# Altium schematic sheet MotorCtrl.SchDoc
size A4; Revision: B.1(PCB.SCH)
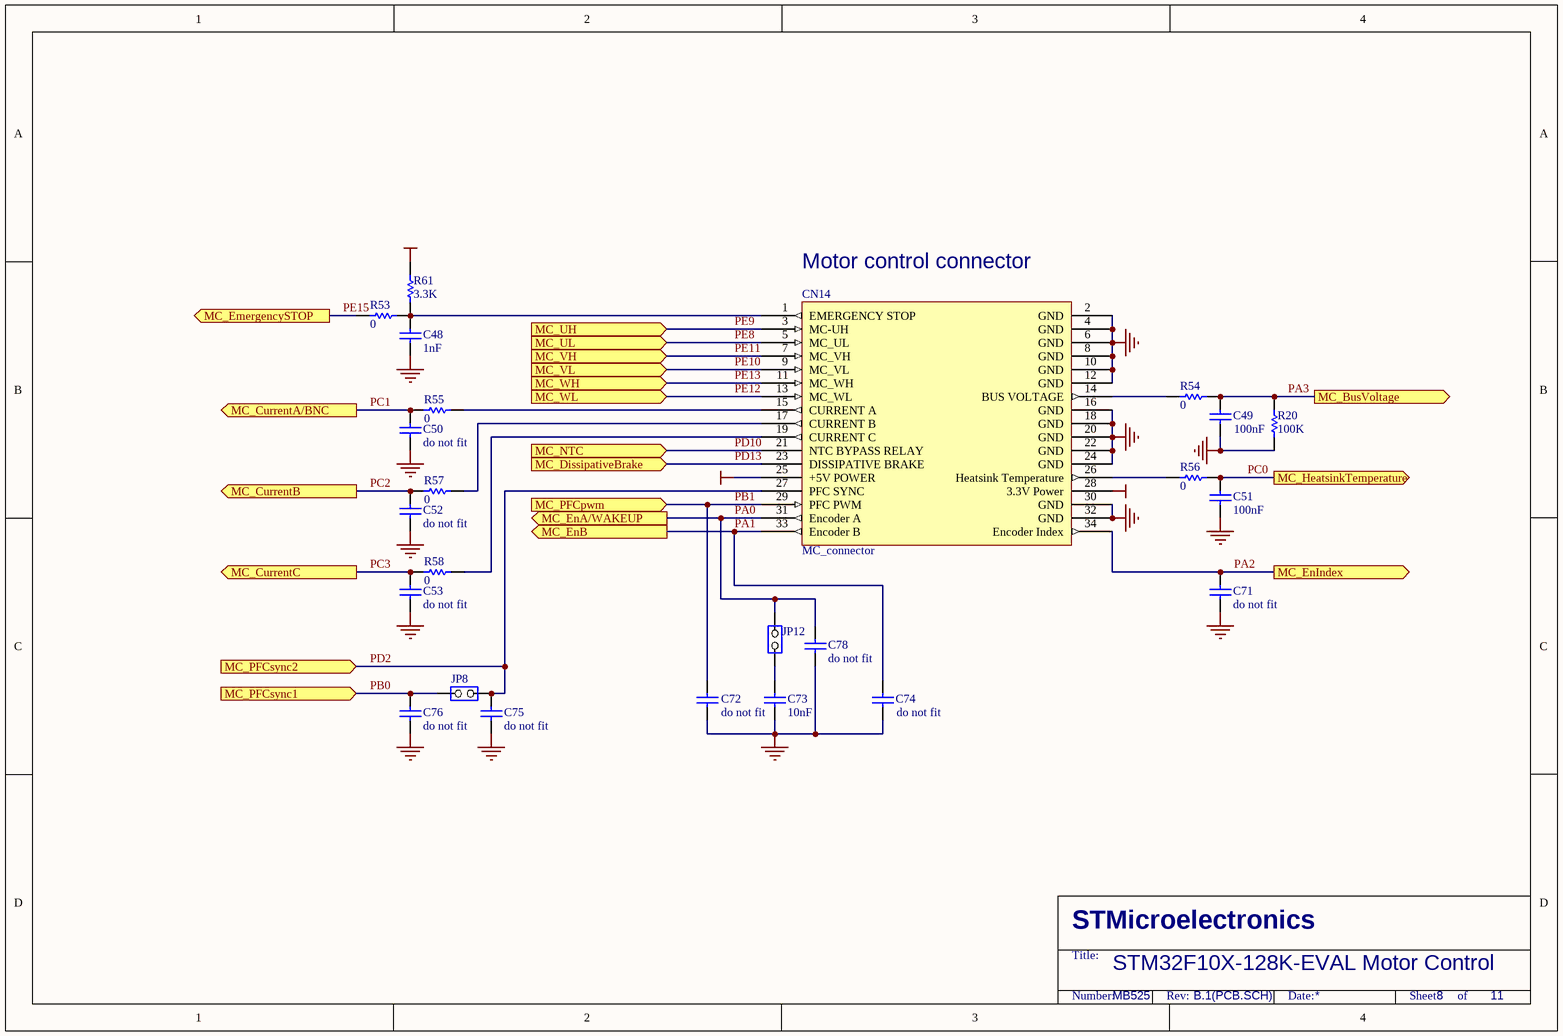
[diagram p0: MotorCtrl.SchDoc]

## Parts
C48  1nF  [0603]
C49  100nF  [0603]
C50  do not fit  [0603]
C51  100nF  [0603]
C52  do not fit  [0603]
C53  do not fit  [0603]
C71  do not fit  [0603]
C72  do not fit  [0603]
C73  10nF  [0603]
C74  do not fit  [0603]
C75  do not fit  [0603]
C76  do not fit  [0603]
C78  do not fit  [0603]
CN14  MC_connector  [IDC34S]
JP8  (no value)  [SIP2]
JP12  (no value)  [SIP2]
R20  100K  [0603]
R53  0  [0805]
R54  0  [0603]
R55  0  [0603]
R56  0  [0603]
R57  0  [0603]
R58  0  [0603]
R61  3.3K  [0603]

## Ports
MC_BusVoltage (out), MC_CurrentA/BNC (out), MC_CurrentB (out), MC_CurrentC (out), MC_DissipativeBrake (in), MC_EmergencySTOP (out), MC_EnA/WAKEUP (out), MC_EnB (out), MC_EnIndex (out), MC_HeatsinkTemperature (out), MC_NTC (in), MC_PFCpwm (in), MC_PFCsync1 (in), MC_PFCsync2 (in), MC_UH (in), MC_UL (in), MC_VH (in), MC_VL (in), MC_WH (in), MC_WL (in)

## Nets
+3V3: CN14.28(3.3V_Power) R61.2
+5V: CN14.25(+5V_POWER)
GND: C48.1 C49.1 C50.1 C51.1 C52.1 C53.1 C71.1 C72.1 C73.1 C74.1 C75.1 C76.1 C78.1 CN14.2(GND) CN14.4(GND) CN14.6(GND) CN14.8(GND) CN14.10(GND) CN14.12(GND) CN14.16(GND) CN14.18(GND) CN14.20(GND) CN14.22(GND) CN14.24(GND) CN14.30(GND) CN14.32(GND) R20.1
PA0: C78.2 CN14.31(Encoder_A) JP12.1(COMMON) ; port MC_EnA/WAKEUP
PA1: C74.2 CN14.33(Encoder_B) ; port MC_EnB
PA2: C71.2 CN14.34(Encoder_Index) ; port MC_EnIndex
PA3: C49.2 R20.2 R54.2 ; port MC_BusVoltage
PB0: C76.2 JP8.2(NO) ; port MC_PFCsync1
PB1: C72.2 CN14.29(PFC_PWM) ; port MC_PFCpwm
PC0: C51.2 R56.2 ; port MC_HeatsinkTemperature
PC1: C50.2 R55.1 ; port MC_CurrentA/BNC
PC2: C52.2 R57.1 ; port MC_CurrentB
PC3: C53.2 R58.1 ; port MC_CurrentC
PD2: C75.2 CN14.27(PFC_SYNC) JP8.1(COMMON) ; port MC_PFCsync2
PD10: CN14.21(NTC_BYPASS_RELAY) ; port MC_NTC
PD13: CN14.23(DISSIPATIVE_BRAKE) ; port MC_DissipativeBrake
PE8: CN14.5(MC_UL) ; port MC_UL
PE9: CN14.3(MC-UH) ; port MC_UH
PE10: CN14.9(MC_VL) ; port MC_VL
PE11: CN14.7(MC_VH) ; port MC_VH
PE12: CN14.13(MC_WL) ; port MC_WL
PE13: CN14.11(MC_WH) ; port MC_WH
PE15: R53.2 ; port MC_EmergencySTOP
NetC48_2: C48.2 CN14.1(EMERGENCY_STOP) R53.1 R61.1
NetC73_2: C73.2 JP12.2(NO)
NetCN14_14: CN14.14(BUS_VOLTAGE) R54.1
NetCN14_15: CN14.15(CURRENT_A) R55.2
NetCN14_17: CN14.17(CURRENT_B) R57.2
NetCN14_19: CN14.19(CURRENT_C) R58.2
NetCN14_26: CN14.26(Heatsink_Temperature) R56.1

## Notes on the sheet
- (near CN14) Motor control connector
- STM32F10X-128K-EVAL Motor Control
- MB525
- 8
- 11
- STMicroelectronics
- Title:
- Number:
- Rev:
- Date:
- Sheet       of

## Library data of the parts
C48 = CAP: Capacitor; Value: 100pF; Published: 8-Jun-2000; Revision: July-2002: Re-released for DXP Platform.; Publisher: Altium Limited
C49-C53 C71-C76 C78 = cap: Capacitor; Value: 100pF; Published: 8-Jun-2000; Revision: July-2002: Re-released for DXP Platform.; Publisher: Altium Limited
JP8 JP12 = JP2
R20 R53-R58 R61 = Res1: Resistor; Value: 1K; Published: 8-Jun-2000; Revision: July-2002: Re-released for DXP Platform.; Publisher: Altium Limited